# Altium schematic sheet flash.SchDoc: Control Plane
size Letter; Author: Ye-Sheng Kuo; Revision: 2; SheetNumber: 5; SheetTotal: 8
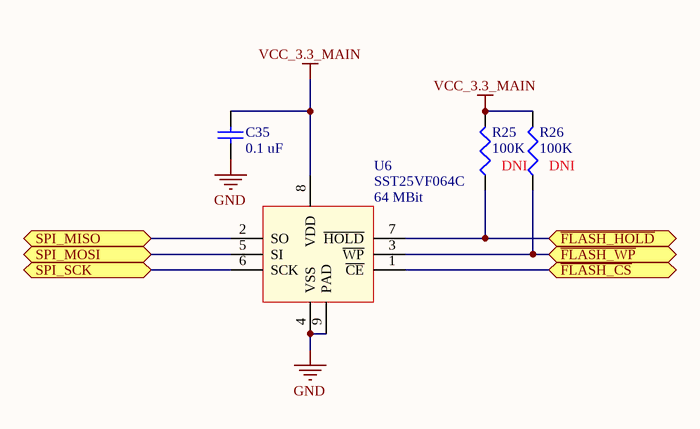
[diagram p0: flash.SchDoc]

## Parts
C35  value 0.1 uF  [0402]  (hidden comment: Ceramic capacitor)
R25  value 100K  [0402]  (hidden comment: Chip resistor)
R26  value 100K  [0402]  (hidden comment: Chip resistor)
U6  SST25VF064C  Capacity: 64 MBit  [WSON]

## Ports
SPI_MISO, SPI_MOSI, SPI_SCK, ~{FLASH_CS}, ~{FLASH_HOLD}, ~{FLASH_WP}

## Nets
GND: C35.2 U6.4(VSS) U6.9(PAD)
VCC_3.3_MAIN: C35.1 R25.1 R26.1 U6.8(VDD)
~{FLASH_CS}: U6.1(~{CE}) ; port ~{FLASH_CS}
~{FLASH_HOLD}: R25.2 U6.7(~{HOLD}) ; port ~{FLASH_HOLD}
~{FLASH_WP}: R26.2 U6.3(~{WP}) ; port ~{FLASH_WP}
SPI_MISO: U6.2(SO) ; port SPI_MISO
SPI_MOSI: U6.5(SI) ; port SPI_MOSI
SPI_SCK: U6.6(SCK) ; port SPI_SCK

## Notes on the sheet
- DNI
- (near R26) DNI
- Title
- Date:
- Author:
- Revision:
- Sheet
- of
- University of Michigan
- File:

## Library data of the parts
C35 = C_0.1u_10V_0402_ceramic: Ceramic capacitor, 0.1u, 0402 package; Manufacture: TDK; voltage rated: 10 V; tolerance: 10%; Supplier 1: Digi-Key; Supplier Part Number 1: 445-1265-1-ND; package: 0402
R25 R26 = R_100K_0402: Chip resistor, 100K, 0402 package; tolerance: 1%; power: 1/16 W; Supplier 1: Digi-Key; Supplier Part Number 1: 541-100KLCT-ND; package: 0402
U6 = SST25VF064C: 64 Mbit SPI Serial Dual I/O Flash; Supplier 1: Digi-Key; Supplier Part Number 1: SST25VF064C-80-4I-Q2AE-CT-ND